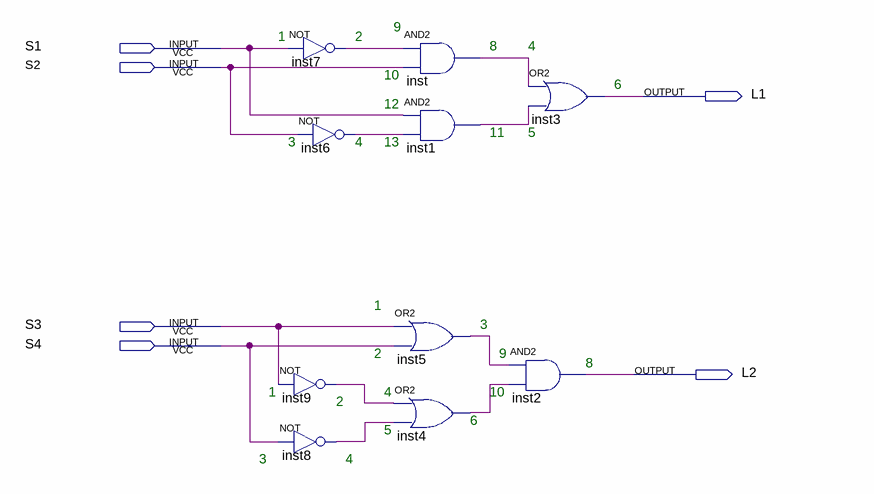
[diagram p0: schematic sheet]
// Quartus schematic Lab03_Q3.bdf as structural Verilog: 10 symbols, 6 pins
module Lab03_Q3 (
  input  S1,
  input  S2,
  input  S3,
  input  S4,
  output L1,
  output L2
);

  wire inst1_out, inst4_out, inst5_out, inst6_out, inst7_out, inst8_out, inst9_out, inst_out;

  not inst7 (inst7_out, S1);
  not inst6 (inst6_out, S2);
  not inst9 (inst9_out, S3);
  not inst8 (inst8_out, S4);
  and inst (inst_out, inst7_out, S2);
  and inst1 (inst1_out, S1, inst6_out);
  or inst5 (inst5_out, S3, S4);
  or inst4 (inst4_out, inst9_out, inst8_out);
  or inst3 (L1, inst_out, inst1_out);
  and inst2 (L2, inst5_out, inst4_out);

  // Notes on the sheet:
  //   9
  //   1
  //   2
  //   8
  //   4
  //   10
  //   6
  //   12
  //   11
  //   5
  //   3
  //   4
  //   13
  //   1
  //   3
  //   2
  //   9
  //   8
  //   1
  //   4
  //   10
  //   2
  //   6
  //   5
  //   3
  //   4
endmodule
